# Altium schematic sheet thermistors-connectors.SchDoc
size A4
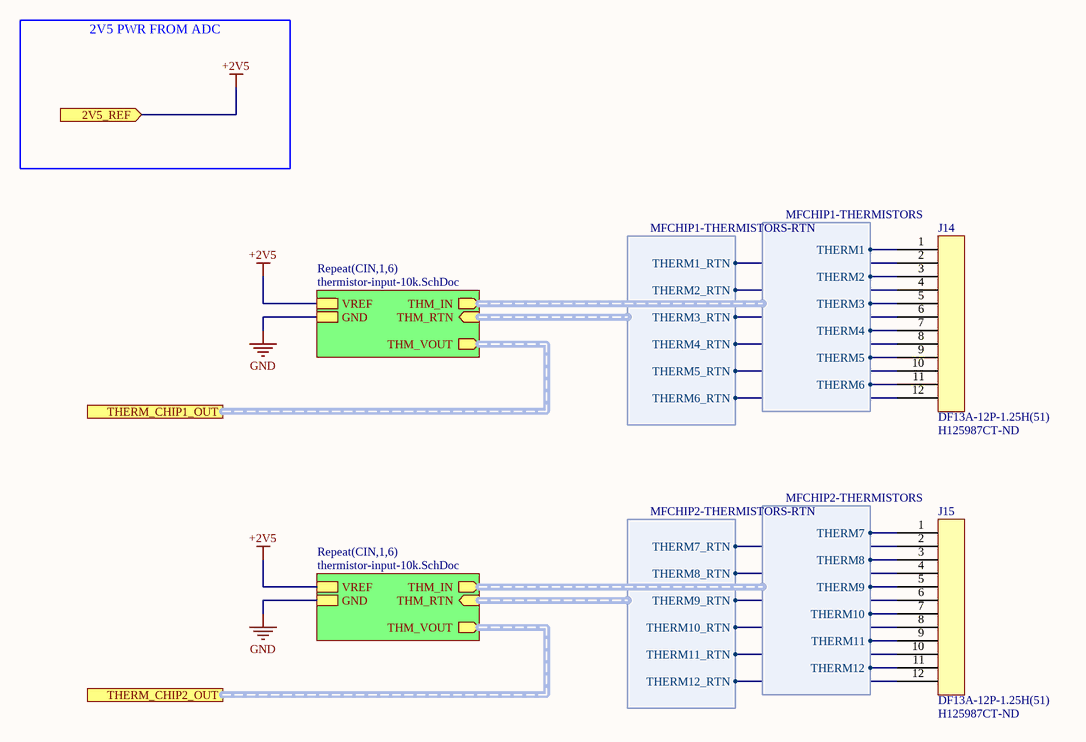
[diagram p0: thermistors-connectors.SchDoc]

## Parts
J14  DF13A-12P-1.25H(51)  Supplier Part Number 1: H125987CT-ND  [PCBComponent_1]
J15  DF13A-12P-1.25H(51)  Supplier Part Number 1: H125987CT-ND  [PCBComponent_1]

## Sub-sheets
Repeat(CIN,1,6) = thermistor-input-10k.SchDoc: GND, VREF, THM_VOUT (out, harness MFCHIP2-THERMISTORS), THM_RTN (in, harness MFCHIP2-THERMISTORS-RTN), THM_IN (out, harness MFCHIP2-THERMISTORS)
Repeat(CIN,1,6) = thermistor-input-10k.SchDoc: GND, VREF, THM_VOUT (out, harness MFCHIP2-THERMISTORS), THM_RTN (in, harness MFCHIP1-THERMISTORS-RTN), THM_IN (out, harness MFCHIP1-THERMISTORS)

## Ports
2V5_REF (in), THERM_CHIP1_OUT (harness MFCHIP1-THERMISTORS-RTN), THERM_CHIP2_OUT (harness MFCHIP2-THERMISTORS-RTN)

## Harnesses
MFCHIP1-THERMISTORS: THERM1, THERM2, THERM3, THERM4, THERM5, THERM6
MFCHIP1-THERMISTORS-RTN: THERM1_RTN, THERM4_RTN, THERM5_RTN, THERM6_RTN, THERM2_RTN, THERM3_RTN
MFCHIP2-THERMISTORS: THERM7, THERM8, THERM9, THERM10, THERM11, THERM12
MFCHIP2-THERMISTORS-RTN: THERM7_RTN, THERM8_RTN, THERM9_RTN, THERM10_RTN, THERM11_RTN, THERM12_RTN

## Nets
+2V5: port 2V5_REF, sheet Repeat(CIN,1,6)/VREF, sheet Repeat(CIN,1,6)/VREF
GND: sheet Repeat(CIN,1,6)/GND, sheet Repeat(CIN,1,6)/GND
NetJ14_1: J14.1 ; sheet Repeat(CIN,1,6)/THM_IN.THERM1
NetJ14_2: J14.2 ; sheet Repeat(CIN,1,6)/THM_RTN.THERM1_RTN
NetJ14_3: J14.3 ; sheet Repeat(CIN,1,6)/THM_IN.THERM2
NetJ14_4: J14.4 ; sheet Repeat(CIN,1,6)/THM_RTN.THERM2_RTN
NetJ14_5: J14.5 ; sheet Repeat(CIN,1,6)/THM_IN.THERM3
NetJ14_6: J14.6 ; sheet Repeat(CIN,1,6)/THM_RTN.THERM3_RTN
NetJ14_7: J14.7 ; sheet Repeat(CIN,1,6)/THM_IN.THERM4
NetJ14_8: J14.8 ; sheet Repeat(CIN,1,6)/THM_RTN.THERM4_RTN
NetJ14_9: J14.9 ; sheet Repeat(CIN,1,6)/THM_IN.THERM5
NetJ14_10: J14.10 ; sheet Repeat(CIN,1,6)/THM_RTN.THERM5_RTN
NetJ14_11: J14.11 ; sheet Repeat(CIN,1,6)/THM_IN.THERM6
NetJ14_12: J14.12 ; sheet Repeat(CIN,1,6)/THM_RTN.THERM6_RTN
NetJ15_1: J15.1 ; sheet Repeat(CIN,1,6)/THM_IN.THERM7
NetJ15_2: J15.2 ; sheet Repeat(CIN,1,6)/THM_RTN.THERM7_RTN
NetJ15_3: J15.3 ; sheet Repeat(CIN,1,6)/THM_IN.THERM8
NetJ15_4: J15.4 ; sheet Repeat(CIN,1,6)/THM_RTN.THERM8_RTN
NetJ15_5: J15.5 ; sheet Repeat(CIN,1,6)/THM_IN.THERM9
NetJ15_6: J15.6 ; sheet Repeat(CIN,1,6)/THM_RTN.THERM9_RTN
NetJ15_7: J15.7 ; sheet Repeat(CIN,1,6)/THM_IN.THERM10
NetJ15_8: J15.8 ; sheet Repeat(CIN,1,6)/THM_RTN.THERM10_RTN
NetJ15_9: J15.9 ; sheet Repeat(CIN,1,6)/THM_IN.THERM11
NetJ15_10: J15.10 ; sheet Repeat(CIN,1,6)/THM_RTN.THERM11_RTN
NetJ15_11: J15.11 ; sheet Repeat(CIN,1,6)/THM_IN.THERM12
NetJ15_12: J15.12 ; sheet Repeat(CIN,1,6)/THM_RTN.THERM12_RTN

## Buses and harness runs
harness port THERM_CHIP1_OUT = sheet Repeat(CIN,1,6)/THM_VOUT
harness port THERM_CHIP2_OUT = sheet Repeat(CIN,1,6)/THM_VOUT

## Notes on the sheet
- 2V5 PWR FROM ADC

## Library data of the parts
J14 J15 = DF13A-12P-1.25H(51): 12 pos DF13 right angle surface mount connector; Manufacturer: Hirose; Current Rating: 1A; Voltage Rating: 150V; Contact Resistance: 30mR; Number of Positions: 12; Pitch: 1.25mm; Supplier 1: Digi-Key; Manufacturer Part Number: DF13A-12P-1.25H(51); Stock 1: 878; Pricing 1: 1=1.69, 10=1.536, 100=1.3167, 500=1.09726 (USD); Contact Material: Brass,Copper Alloy; Contact Plating: Gold; Housing Color: Beige; Housing Material: Polyamide; Min Operating Temperature: -35°C; Max Operating Temperature: 85°C; Contact Gender: Male; Package Quantity: 1000; Number of Rows: 1; Packaging: Tape and Reel; Max Current Rating: 1A; Termination: Solder; Number of Contacts: 12; Max Voltage Rating (AC): 150V; Orientation: Right Angle; Length: 19.65mm; Depth: 6.5mm; Radiation Hardening: No; Lead Free: Lead Free; ComponentLink1URL: http://www.mouser.com/ds/2/185/DF13_catalog-939190.pdf?src-supplier=Mouser; ComponentLink1Description: http://www.mouser.com/ds/2/185/DF13_catalog-939190.pdf?src-supplier=Mouser; ComponentLink2URL: http://www.hirose.co.jp/cataloge_hp/en_DF13_20130411.pdf?src-supplier=Future+Electronics; ComponentLink2Description: http://www.hirose.co.jp/cataloge_hp/en_DF13_20130411.pdf?src-supplier=Future+Electronics; ComponentLink3URL: https://www.verical.com/server-webapp/html/getDatasheet?partID=429813&src-supplier=Verical; ComponentLink3Description: https://www.verical.com/server-webapp/html/getDatasheet?partID=429813&src-supplier=Verical